# Altium project PuttPilot-Node.PrjPcb (part 2 of 2)

## Sheet Servo-Power.SchDoc: Servo-Power
size 279 x 215 mm; DrawnBy: Ethan Abraham; Engineer: ethan Abraham; SheetNumber: 3; SheetTotal: 6
Used 3 times, as channels B1, B2, B3. Parts and nets are listed once, with the designators drawn on the sheet.
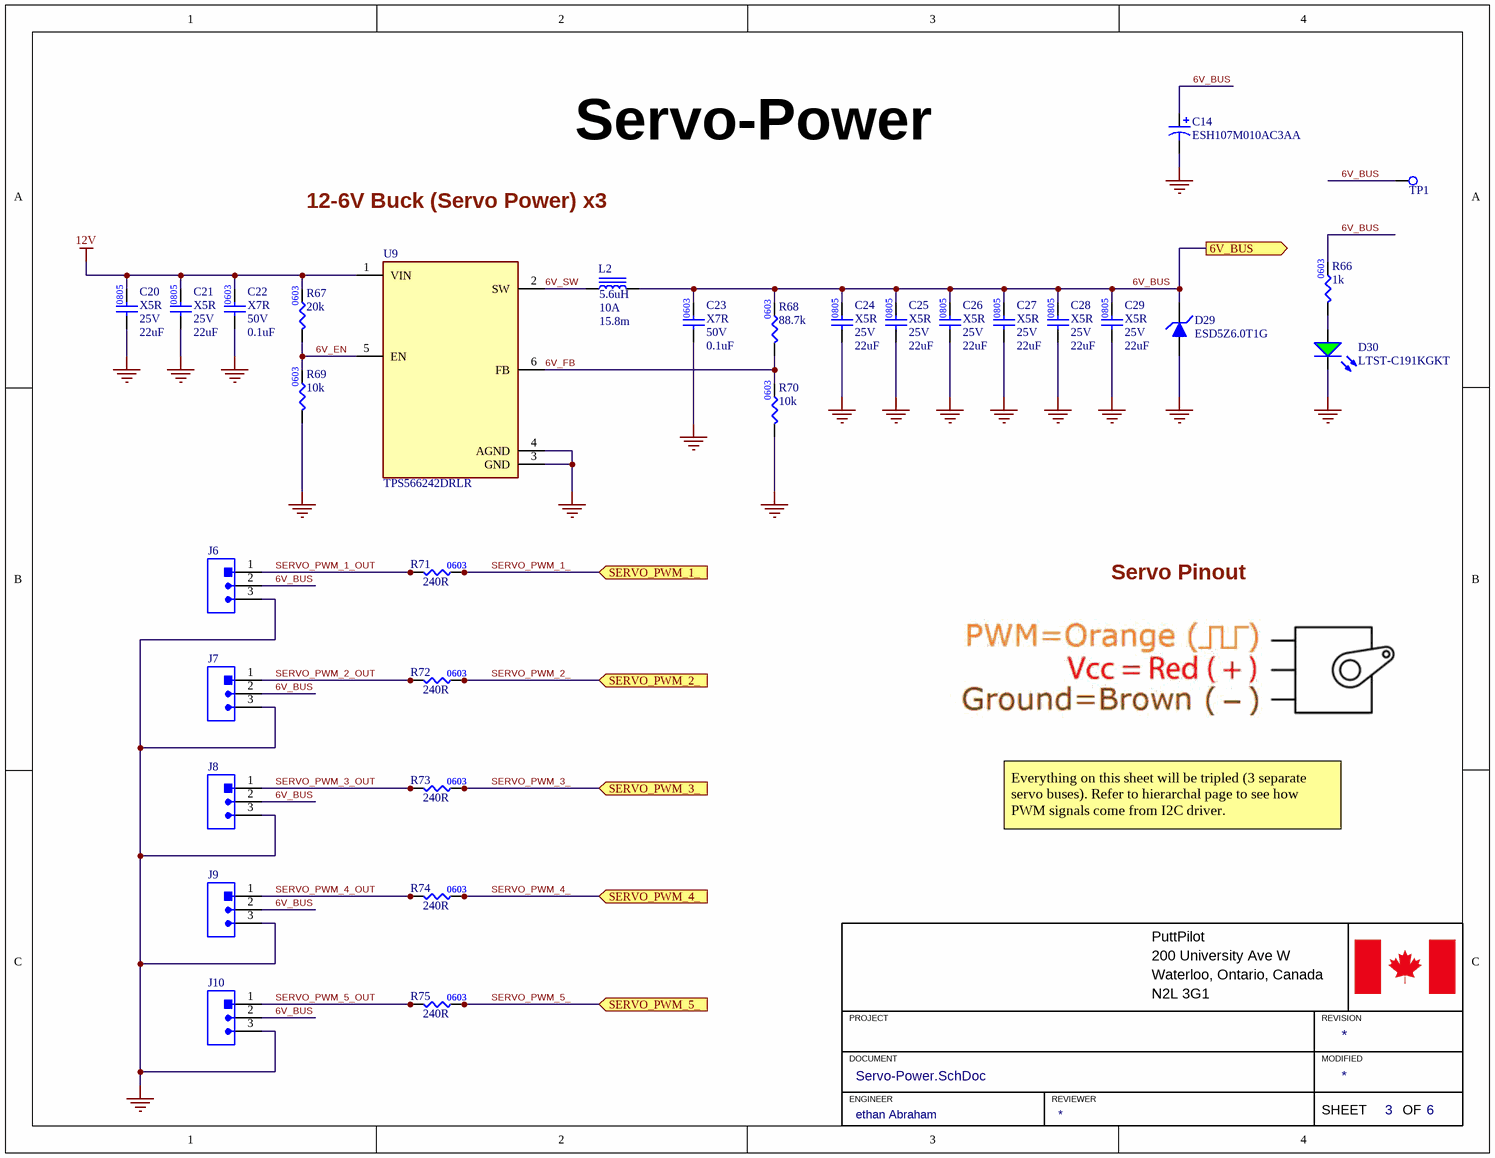
[diagram p3: Servo-Power.SchDoc]

### Parts
C14  ESH107M010AC3AA  [ESH107M010AC3AA]
C20  Temperature Characteristics Code: X5R  Rated DC Voltage (URdc): 25V  Capacitance: 22uF  [.CAP_0805]  (hidden comment: GRM21BR61E226ME44K)
C21  Temperature Characteristics Code: X5R  Rated DC Voltage (URdc): 25V  Capacitance: 22uF  [.CAP_0805]  (hidden comment: GRM21BR61E226ME44K)
C22  Temperature Characteristics Code: X7R  Rated DC Voltage (URdc): 50V  Capacitance: 0.1uF  [.CAP_0603]  (hidden comment: GCJ188R71H104KA12D)
C23  Temperature Characteristics Code: X7R  Rated DC Voltage (URdc): 50V  Capacitance: 0.1uF  [.CAP_0603]  (hidden comment: GCJ188R71H104KA12D)
C24  Temperature Characteristics Code: X5R  Rated DC Voltage (URdc): 25V  Capacitance: 22uF  [.CAP_0805]  (hidden comment: GRM21BR61E226ME44K)
C25  Temperature Characteristics Code: X5R  Rated DC Voltage (URdc): 25V  Capacitance: 22uF  [.CAP_0805]  (hidden comment: GRM21BR61E226ME44K)
C26  Temperature Characteristics Code: X5R  Rated DC Voltage (URdc): 25V  Capacitance: 22uF  [.CAP_0805]  (hidden comment: GRM21BR61E226ME44K)
C27  Temperature Characteristics Code: X5R  Rated DC Voltage (URdc): 25V  Capacitance: 22uF  [.CAP_0805]  (hidden comment: GRM21BR61E226ME44K)
C28  Temperature Characteristics Code: X5R  Rated DC Voltage (URdc): 25V  Capacitance: 22uF  [.CAP_0805]  (hidden comment: GRM21BR61E226ME44K)
C29  Temperature Characteristics Code: X5R  Rated DC Voltage (URdc): 25V  Capacitance: 22uF  [.CAP_0805]  (hidden comment: GRM21BR61E226ME44K)
D29  ESD5Z6.0T1G  [ESD5Z6.0T1G]
D30  LTST-C191KGKT  [.LED_0603]
J6  PRPC040SAAN-RC  [HEADER_3POS_2.54MM]  (value not drawn)
J7  PRPC040SAAN-RC  [HEADER_3POS_2.54MM]  (value not drawn)
J8  PRPC040SAAN-RC  [HEADER_3POS_2.54MM]  (value not drawn)
J9  PRPC040SAAN-RC  [HEADER_3POS_2.54MM]  (value not drawn)
J10  PRPC040SAAN-RC  [HEADER_3POS_2.54MM]  (value not drawn)
L2  Inductance: 5.6uH  Current Rating: 10A  DC Resistance: 15.8m  [SRP6060FA-5R6M]  (hidden comment: SRP6060FA-5R6M)
R66  Resistance: 1k  [.RES_0603]  (hidden comment: RC0603FR-071KL)
R67  Resistance: 20k  [.RES_0603]  (hidden comment: ERJ-3EKF2002V)
R68  Resistance: 88.7k  [.RES_0603]  (hidden comment: RC0603FR-0788K7L)
R69  Resistance: 10k  [.RES_0603]  (hidden comment: RC0603FR-0710KL)
R70  Resistance: 10k  [.RES_0603]  (hidden comment: RC0603FR-0710KL)
R71  Resistance: 240R  [.RES_0603]  (hidden comment: RC0603FR-07240RL)
R72  Resistance: 240R  [.RES_0603]  (hidden comment: RC0603FR-07240RL)
R73  Resistance: 240R  [.RES_0603]  (hidden comment: RC0603FR-07240RL)
R74  Resistance: 240R  [.RES_0603]  (hidden comment: RC0603FR-07240RL)
R75  Resistance: 240R  [.RES_0603]  (hidden comment: RC0603FR-07240RL)
TP1  RCWCTE  [RCWCTE]  (value not drawn)
U9  TPS566242DRLR  [TPS566242DRLR]

### Ports
6V_BUS (out), SERVO_PWM_1_ (in), SERVO_PWM_2_ (in), SERVO_PWM_3_ (in), SERVO_PWM_4_ (in), SERVO_PWM_5_ (in)

### Nets
12V: C20.2 C21.2 C22.2 R67.2 U9.1(VIN)
GND: C14.2 C20.1 C21.1 C22.1 C23.1 C24.1 C25.1 C26.1 C27.1 C28.1 C29.1 D29.2(Anode) D30.2(K) J6.3 J7.3 J8.3 J9.3 J10.3 R69.1 R70.1 U9.3(GND) U9.4(AGND)
6V_BUS: C14.1 C23.2 C24.2 C25.2 C26.2 C27.2 C28.2 C29.2 D29.1(Cathode) J6.2 J7.2 J8.2 J9.2 J10.2 L2.2 R66.2 R68.2 TP1.1 ; port 6V_BUS
6V_EN: R67.1 R69.2 U9.5(EN)
6V_FB: R68.1 R70.2 U9.6(FB)
6V_SW: L2.1 U9.2(SW)
SERVO_PWM_1_: R71.2 ; port SERVO_PWM_1_
SERVO_PWM_1_OUT: J6.1 R71.1
SERVO_PWM_2_: R72.2 ; port SERVO_PWM_2_
SERVO_PWM_2_OUT: J7.1 R72.1
SERVO_PWM_3_: R73.2 ; port SERVO_PWM_3_
SERVO_PWM_3_OUT: J8.1 R73.1
SERVO_PWM_4_: R74.2 ; port SERVO_PWM_4_
SERVO_PWM_4_OUT: J9.1 R74.1
SERVO_PWM_5_: R75.2 ; port SERVO_PWM_5_
SERVO_PWM_5_OUT: J10.1 R75.1
NetD30_1: D30.1(A) R66.1

### Channels
B1: designators end in _B1; ports 6V_BUS=6V_BUS_B1 SERVO_PWM_1_=SERVO_PWM_1__B1 SERVO_PWM_2_=SERVO_PWM_2__B1 SERVO_PWM_3_=SERVO_PWM_3__B1 SERVO_PWM_4_=SERVO_PWM_4__B1 SERVO_PWM_5_=SERVO_PWM_5__B1
B2: designators end in _B2; ports 6V_BUS=6V_BUS_B2 SERVO_PWM_1_=SERVO_PWM_1__B2 SERVO_PWM_2_=SERVO_PWM_2__B2 SERVO_PWM_3_=SERVO_PWM_3__B2 SERVO_PWM_4_=SERVO_PWM_4__B2 SERVO_PWM_5_=SERVO_PWM_5__B2
B3: designators end in _B3; ports 6V_BUS=6V_BUS SERVO_PWM_1_=SERVO_PWM_1__B3 SERVO_PWM_2_=SERVO_PWM_2__B3 SERVO_PWM_3_=SERVO_PWM_3__B3 SERVO_PWM_4_=SERVO_PWM_4__B3 SERVO_PWM_5_=SERVO_PWM_5__B3

### Notes on the sheet
- 12-6V Buck (Servo Power) x3
- Servo Pinout
- Everything on this sheet will be tripled (3 separate servo buses). Refer to hierarchal page to see how PWM signals come from I2C driver.
- PuttPilot
- 200 University Ave W
- PROJECT
- Waterloo, Ontario, Canada
- N2L 3G1
- REVISION
- DOCUMENT
- ENGINEER
- REVIEWER
- MODIFIED
- SHEET
- OF

### Library data of the parts
C14 = ESH107M010AC3AA: CAP ALUM 100uF 10V RAD THT
C20 C21 C24-C29 = GRM21BR61E226ME44K: CAP CER 22uF 25V X5R 0805; Manufacturer: Murata; Dielectric Material: Ceramic; Multilayer: Yes; Negative Tolerance: 20%; Supplier 1: Future Electronics; Manufacturer Part Number: GRM21BR61E226ME44K; RoHS: Yes; Category: Ceramic Capacitors; Stock 1: 60000; Pricing 1: 10000=0.0684, 20000=0.0672, 30000=0.0661 (USD); Mount: Surface Mount; Number of Pins: 2; Package Shape: Rectangular; Size Code: 0805; Terminal Finish: Nickel; Min Operating Temperature: -55°C; Max Operating Temperature: 85°C; JESD-609 Code: e3; Capacitor Type: Ceramic; Package Style: SMTMeter; Packaging: Tape and Reel; Positive Tolerance: 20%; Termination: Wraparound; Length: 2mm; Width: 1.25mm; Height: 1.25mm; Reach SVHC Compliant: Yes; RoHS Compliant: Yes; ComponentLink1URL: https://datasheet.ciiva.com:443/pdfs/VipMasterIC/IC/MURE/MURE-S-A0002977178/MURE-S-A0002978778-1.pdf?src-supplier=IHS+Markit; ComponentLink1Description: https://datasheet.ciiva.com:443/pdfs/VipMasterIC/IC/MURE/MURE-S-A0002977178/MURE-S-A0002978778-1.pdf?src-supplier=IHS+Markit; ComponentLink2URL: http://www.mouser.com/ds/2/281/c02e-2905.pdf?src-supplier=Mouser; ComponentLink2Description: http://www.mouser.com/ds/2/281/c02e-2905.pdf?src-supplier=Mouser; ComponentLink3URL: https://datasheet.octopart.com/GRM21BR61E226ME44K-Murata-datasheet-155345081.pdf?src-supplier=Element14; ComponentLink3Description: https://datasheet.octopart.com/GRM21BR61E226ME44K-Murata-datasheet-155345081.pdf?src-supplier=Element14; ComponentLink4URL: http://search.murata.co.jp/Ceramy/image/img/A01X/G101/ENG/GRM21BR61E226ME44-01.pdf?src-supplier=Digikey; ComponentLink4Description: http://search.murata.co.jp/Ceramy/image/img/A01X/G101/ENG/GRM21BR61E226ME44-01.pdf?src-supplier=Digikey; ComponentLink5URL: https://search.murata.co.jp/Ceramy/image/img/A01X/G101/ENG/GRM21BR61E226ME44-01.pdf?src-supplier=Digikey; ComponentLink5Description: https://search.murata.co.jp/Ceramy/image/img/A01X/G101/ENG/GRM21BR61E226ME44-01.pdf?src-supplier=Digikey; ComponentLink6URL: https://datasheet.octopart.com/GRM21BR61E226ME44K-Murata-datasheet-99353850.pdf?src-supplier=Future+Electronics; ComponentLink6Description: https://datasheet.octopart.com/GRM21BR61E226ME44K-Murata-datasheet-99353850.pdf?src-supplier=Future+Electronics; ComponentLink7URL: https://datasheet.octopart.com/GRM21BR61E226ME44K-Murata-datasheet-155345081.pdf?src-supplier=Newark; ComponentLink7Description: https://datasheet.octopart.com/GRM21BR61E226ME44K-Murata-datasheet-155345081.pdf?src-supplier=Newark; ComponentLink8URL: https://datasheet.octopart.com/GRM21BR61E226ME44K-Murata-datasheet-165579666.pdf?src-supplier=TME; ComponentLink8Description: https://datasheet.octopart.com/GRM21BR61E226ME44K-Murata-datasheet-165579666.pdf?src-supplier=TME; Supplier Part Number 1: 1092989
C22 C23 = GCJ188R71H104KA12D: CAP CER 0.1uF 50V X7R 0603; Manufacturer: Murata; Dielectric Material: Ceramic; Multilayer: Yes; Negative Tolerance: 10%; Reference Standard: AEC-Q200; Supplier 1: Future Electronics; Manufacturer Part Number: GCJ188R71H104KA12D; RoHS: Yes; Category: Ceramic Capacitors; Stock 1: 3280000; Pricing 1: 4000=0.0182, 12000=0.0178, 20000=0.0176, 80000=0.017, 120000=0.0167 (USD); Mount: Surface Mount; Number of Pins: 2; Package Shape: Rectangular; Size Code: 0603; Terminal Finish: Nickel; Min Operating Temperature: -55°C; Max Operating Temperature: 125°C; JESD-609 Code: e3; Capacitor Type: Ceramic; Package Style: SMTMeter; Packaging: Tape and Reel; Positive Tolerance: 10%; Termination: Wraparound; Length: 1.6mm; Width: 0.8mm; Height: 0.8mm; Reach SVHC Compliant: Yes; RoHS Compliant: Yes; ComponentLink1URL: https://psearch.en.murata.com:443/capacitor/product/GCJ188R71H104KA12%23.pdf?src-supplier=IHS+Markit; ComponentLink1Description: https://psearch.en.murata.com:443/capacitor/product/GCJ188R71H104KA12%23.pdf?src-supplier=IHS+Markit; ComponentLink2URL: https://datasheet.ciiva.com/135/product-135604.pdf?src-supplier=Digikey; ComponentLink2Description: https://datasheet.ciiva.com/135/product-135604.pdf?src-supplier=Digikey; ComponentLink3URL: https://datasheet.ciiva.com/26889/getdatasheetpartid-369886-26889118.pdf?src-supplier=Verical; ComponentLink3Description: https://datasheet.ciiva.com/26889/getdatasheetpartid-369886-26889118.pdf?src-supplier=Verical; ComponentLink4URL: https://datasheet.ciiva.com/135/s0717e-135605.pdf?src-supplier=Digikey; ComponentLink4Description: https://datasheet.ciiva.com/135/s0717e-135605.pdf?src-supplier=Digikey; ComponentLink5URL: https://datasheet.ciiva.com/135/s0717e-135606.pdf?src-supplier=Digikey; ComponentLink5Description: https://datasheet.ciiva.com/135/s0717e-135606.pdf?src-supplier=Digikey; ComponentLink6URL: https://datasheet.ciiva.com/16440/c03e-16440425.pdf?src-supplier=Future+Electronics; ComponentLink6Description: https://datasheet.ciiva.com/16440/c03e-16440425.pdf?src-supplier=Future+Electronics; Supplier Part Number 1: 1158604
D29 = ESD5Z6.0T1G: DIODE TVS 6VWM; Manufacturer: ON Semiconductor; Diode Element Material: SILICON; Package Body Material: Plastic; Polarity: Unidirectional; Additional Feature: UL RECOGNIZED; Min Breakdown Voltage: 6.8V; Clamping Voltage-Max: 12.4V; Diode Type: TRANS VOLTAGE SUPPRESSOR; Non-rep Peak Rev Power Dis-Max: 181W; Number of Elements: 1; Max Power Dissipation: 200mW; Rep Pk Reverse Voltage-Max: 6V; Time @ Peak Reflow Temperature-Max (s): 40s; Reference Standard: IEC-61000-4-2; Qualification Status: Not Qualified; Supplier 1: Future Electronics; Manufacturer Part Number: ESD5Z6.0T1G; RoHS: Yes; Category: ESD and Circuit Protection ICs; Stock 1: 543000; Pricing 1: 3000=0.0199, 12000=0.0191, 45000=0.0183, 75000=0.018, 150000=0.0171 (USD); Number of Pins: 2; Package Shape: Rectangular; Terminal Finish: Tin; Min Operating Temperature: -55°C; Max Operating Temperature: 150°C; JESD-609 Code: e3; JESD-30 Code: R-PDSO-F2; Moisture Sensitivity Level: 1; Package Style: SMALL OUTLINEMeter; Surface Mount: Yes; Technology: AVALANCHE; Terminal Form: Flat; Terminal Position: DUAL; Peak Reflow Temperature (Cel): 260°C; Reach SVHC Compliant: Yes; RoHS Compliant: Yes; ComponentLink1URL: https://datasheet.ciiva.com:443/pdfs/VipMasterIC/IC/ONSM/ONSM-S-A0006325923/ONSM-S-A0006325923-1.pdf?src-supplier=IHS+Markit; ComponentLink1Description: https://datasheet.ciiva.com:443/pdfs/VipMasterIC/IC/ONSM/ONSM-S-A0006325923/ONSM-S-A0006325923-1.pdf?src-supplier=IHS+Markit; ComponentLink2URL: https://datasheet.ciiva.com/30478/0900766b8125092b-30478790.pdf?src-supplier=Rs; ComponentLink2Description: https://datasheet.ciiva.com/30478/0900766b8125092b-30478790.pdf?src-supplier=Rs; ComponentLink3URL: https://datasheet.ciiva.com/4510/esd5z2-5t1-d-241596-4510609.pdf?src-supplier=Mouser; ComponentLink3Description: https://datasheet.ciiva.com/4510/esd5z2-5t1-d-241596-4510609.pdf?src-supplier=Mouser; ComponentLink4URL: https://datasheet.ciiva.com/15143/getdatasheetpartid-148103-15143777.pdf?src-supplier=Verical; ComponentLink4Description: https://datasheet.ciiva.com/15143/getdatasheetpartid-148103-15143777.pdf?src-supplier=Verical; ComponentLink5URL: https://datasheet.ciiva.com/22642/1878252-22642024.pdf?src-supplier=Element14; ComponentLink5Description: https://datasheet.ciiva.com/22642/1878252-22642024.pdf?src-supplier=Element14; ComponentLink6URL: https://datasheet.ciiva.com/340/esd5z2-5t1-d-340699.pdf?src-supplier=Digikey; ComponentLink6Description: https://datasheet.ciiva.com/340/esd5z2-5t1-d-340699.pdf?src-supplier=Digikey; ComponentLink7URL: https://datasheet.ciiva.com/340/esd5z2-5t1-d-340700.pdf?src-supplier=Digikey; ComponentLink7Description: https://datasheet.ciiva.com/340/esd5z2-5t1-d-340700.pdf?src-supplier=Digikey; ComponentLink8URL: https://datasheet.ciiva.com/340/esd5z2-5t1-d-340701.pdf?src-supplier=Digikey; ComponentLink8Description: https://datasheet.ciiva.com/340/esd5z2-5t1-d-340701.pdf?src-supplier=Digikey; ComponentLink9URL: https://datasheet.ciiva.com/3304/esd5z2-5t1-d-3304009.pdf?src-supplier=Avnet; ComponentLink9Description: https://datasheet.ciiva.com/3304/esd5z2-5t1-d-3304009.pdf?src-supplier=Avnet; Supplier Part Number 1: 6072663
D30 = LTST-C191KGKT: LED GREEN 2V 0603; Manufacturer: Vishay Lite-On; Shape: Rectangular; Lens Style: WATER CLEAR; Forward Current-Max: 30mA; Luminous Intensity-Nom: 35mcd; Number of Functions: 1; Optoelectronic Device Type: SINGLE COLOR LED; Viewing Angle: 130°; Forward Voltage-Max: 2.4V; Reverse Voltage-Max: 5V; Overall Height: 0.55mm; Supplier 1: Digikey; Manufacturer Part Number: LTST-C191KGKT; RoHS: Yes; Stock 1: 171853; Pricing 1: 1=0.22, 10=0.121, 100=0.0721, 500=0.05324, 1000=0.04748, 2000=0.04278 (USD); Mount: Surface Mount; Number of Pins: 2; Color: Green; Color@wavelength: Green; Terminal Finish: Tin; Min Operating Temperature: -55°C; Max Operating Temperature: 85°C; Packaging: Tape and Reel; JESD-609 Code: e3; Size: 1.1mm; Terminal Pitch: 1.5mm; Reach SVHC Compliant: Yes; RoHS Compliant: Yes; ComponentLink1URL: https://datasheet.ciiva.com:443/pdfs/VipMasterIC/IC/LITE/LITE-S-A0003156116/LITE-S-A0003156116-1.pdf?src-supplier=IHS+Markit; ComponentLink1Description: https://datasheet.ciiva.com:443/pdfs/VipMasterIC/IC/LITE/LITE-S-A0003156116/LITE-S-A0003156116-1.pdf?src-supplier=IHS+Markit; ComponentLink2URL: https://datasheet.ciiva.com/2109/ltst-c191kgkt-2109973.pdf?src-supplier=Digikey; ComponentLink2Description: https://datasheet.ciiva.com/2109/ltst-c191kgkt-2109973.pdf?src-supplier=Digikey; Supplier Part Number 1: 160-1446-1-ND
J6-J10 = PRPC040SAAN-RC: CONN HEADER VERT 3POS 2.54MM; Manufacturer: Sullins; Manufacturer Series: PRP; Connector Type: BOARD CONNECTOR; Contact Pattern: RECTANGULAR; Contact Style: SQ PIN-SKT; Number Of Connectors: 1; Rated Current (Signal): 3A; Number of Contacts: 40; Body Breadth: 0.1inch; Body Length: 4inch; Reference Standard: UL; Reliability: COMMERCIAL; Supplier 1: Digikey; Manufacturer Part Number: PRPC040SAAN-RC; RoHS: Yes; Category: Headers and Wire Housings; Stock 1: 73516; Pricing 1: 1=0.42, 10=0.316, 100=0.2417, 500=0.2017, 1000=0.18701, 5000=0.15795, 10000=0.14845 (USD); Mount: Board; Contact Material: Brass; Contact Finish - Mating: AU ON NI; Contact Finish - Termination: Gold (Au) - with Nickel (Ni) barrier; Insulation Material: Polybutylene; Min Operating Temperature: -40°C; Max Operating Temperature: 105°C; JESD-609 Code: e4; Contact Gender: Male; Mounting Style: STRAIGHT; Number Of PCB Rows: 1; Number of Rows Loaded: 1; PCB Contact Pattern: RECTANGULAR; Termination: Solder; Body Depth: 0.1inch; Mating Contact Pitch: 0.1inch; Terminal Length: 0.12inch; Terminal Pitch: 2.54mm; Reach SVHC Compliant: Yes; RoHS Compliant: Yes; ComponentLink1URL: https://datasheet.ciiva.com:443/pdfs/VipMasterIC/IC/SUCS/SUCSS00322/SUCSS00322-1.pdf?src-supplier=IHS+Markit; ComponentLink1Description: https://datasheet.ciiva.com:443/pdfs/VipMasterIC/IC/SUCS/SUCSS00322/SUCSS00322-1.pdf?src-supplier=IHS+Markit; ComponentLink2URL: https://datasheet.ciiva.com/16477/prpc040saan-rc-16477647.pdf?src-supplier=Future+Electronics; ComponentLink2Description: https://datasheet.ciiva.com/16477/prpc040saan-rc-16477647.pdf?src-supplier=Future+Electronics; ComponentLink3URL: https://datasheet.ciiva.com/741/xrxczzzsxxn-rc-st-11635-b-741205.pdf?src-supplier=Digikey; ComponentLink3Description: https://datasheet.ciiva.com/741/xrxczzzsxxn-rc-st-11635-b-741205.pdf?src-supplier=Digikey; Supplier Part Number 1: S1011EC-02-ND
L2 = SRP6060FA-5R6M: FIXED IND 5.6uH 10A 15.8mOhm; Manufacturer: Bourns; Inductor Type: GENERAL PURPOSE INDUCTOR; Supplier 1: Digikey; Manufacturer Part Number: SRP6060FA-5R6M; RoHS: Yes; Category: Fixed Inductors; Stock 1: 1553; Pricing 1: 1=1.86, 10=1.444, 25=1.3052, 50=1.209, 100=1.1199, 250=1.01164 (USD); Reach SVHC Compliant: Yes; RoHS Compliant: Yes; ComponentLink1URL: https://datasheet.ciiva.com:443/pdfs/VipMasterIC/IC/BOUR/BOUR-S-A0006601820/BOUR-S-A0006601820-1.pdf?src-supplier=IHS+Markit; ComponentLink1Description: https://datasheet.ciiva.com:443/pdfs/VipMasterIC/IC/BOUR/BOUR-S-A0006601820/BOUR-S-A0006601820-1.pdf?src-supplier=IHS+Markit; ComponentLink2URL: https://www.bourns.com/docs/Product-Datasheets/SRP6060FA.pdf?src-supplier=Digikey; ComponentLink2Description: https://www.bourns.com/docs/Product-Datasheets/SRP6060FA.pdf?src-supplier=Digikey; ComponentLink3URL: https://datasheet.octopart.com/SRP6060FA-5R6M-Bourns-datasheet-154834317.pdf?src-supplier=Electro+Sonic; ComponentLink3Description: https://datasheet.octopart.com/SRP6060FA-5R6M-Bourns-datasheet-154834317.pdf?src-supplier=Electro+Sonic; ComponentLink4URL: https://datasheet.octopart.com/SRP6060FA-5R6M-Bourns-datasheet-110646386.pdf?src-supplier=Master+Electronics; ComponentLink4Description: https://datasheet.octopart.com/SRP6060FA-5R6M-Bourns-datasheet-110646386.pdf?src-supplier=Master+Electronics; Supplier Part Number 1: SRP6060FA-5R6MCT-ND
R66 = RC0603FR-071KL: RES 1K OHM 0603; Manufacturer: Yageo; Tolerance: 1%; Additional Feature: LASER TRIMMABLE; Rated Power Dissipation (P): 100mW; Rated Temperature: 70°C; Temperature Coefficient: 100ppm/°C; Working Voltage: 75V; Package Height: 0.45mm; Package Length: 1.6mm; Package Width: 0.8mm; Supplier 1: Future Electronics; Manufacturer Part Number: RC0603FR-071KL; RoHS: Yes; Category: Chip SMD Resistors; Stock 1: 12810000; Pricing 1: 5000=0.0026, 50000=0.0025, 150000=0.0024, 375000=0.0023, 1000000=0.0022 (USD); Mount: Surface Mount; Number of Pins: 2; Package Shape: Rectangular; Size Code: 0603; Terminal Finish: Nickel; Min Operating Temperature: -55°C; Max Operating Temperature: 155°C; JESD-609 Code: e3; Resistor Type: FIXED RESISTOR; Construction: Chip; Package Style: SMTMeter; Packaging: Tape and Reel; Technology: METAL GLAZE/THICK FILM; Termination: Wraparound; Reach SVHC Compliant: Yes; RoHS Compliant: Yes; ComponentLink1URL: https://datasheet.ciiva.com:443/pdfs/VipMasterIC/IC/YAGO/YAGO-S-A0008145938/YAGO-S-A0008145938-1.pdf?src-supplier=IHS+Markit; ComponentLink1Description: https://datasheet.ciiva.com:443/pdfs/VipMasterIC/IC/YAGO/YAGO-S-A0008145938/YAGO-S-A0008145938-1.pdf?src-supplier=IHS+Markit; ComponentLink2URL: https://datasheet.ciiva.com/11808/0900766b80f96399-11808081.pdf?src-supplier=Rs; ComponentLink2Description: https://datasheet.ciiva.com/11808/0900766b80f96399-11808081.pdf?src-supplier=Rs; ComponentLink3URL: https://datasheet.ciiva.com/8896/pyu-rc0603-51-rohs-l-4-8896106.pdf?src-supplier=Avnet; ComponentLink3Description: https://datasheet.ciiva.com/8896/pyu-rc0603-51-rohs-l-4-8896106.pdf?src-supplier=Avnet; ComponentLink4URL: https://datasheet.ciiva.com/7660/1868787-7660790.pdf?src-supplier=Element14; ComponentLink4Description: https://datasheet.ciiva.com/7660/1868787-7660790.pdf?src-supplier=Element14; ComponentLink5URL: https://datasheet.ciiva.com/7746/1738695-7746279.pdf?src-supplier=Element14; ComponentLink5Description: https://datasheet.ciiva.com/7746/1738695-7746279.pdf?src-supplier=Element14; ComponentLink6URL: https://datasheet.ciiva.com/7746/1686128-7746280.pdf?src-supplier=Element14; ComponentLink6Description: https://datasheet.ciiva.com/7746/1686128-7746280.pdf?src-supplier=Element14; ComponentLink7URL: https://datasheet.ciiva.com/7746/1738695-7746281.pdf?src-supplier=Element14; ComponentLink7Description: https://datasheet.ciiva.com/7746/1738695-7746281.pdf?src-supplier=Element14; ComponentLink8URL: https://datasheet.ciiva.com/7983/443971-7983613.pdf?src-supplier=Element14; ComponentLink8Description: https://datasheet.ciiva.com/7983/443971-7983613.pdf?src-supplier=Element14; ComponentLink9URL: https://datasheet.ciiva.com/15189/getdatasheetpartid-404327-15189644.pdf?src-supplier=Verical; ComponentLink9Description: https://datasheet.ciiva.com/15189/getdatasheetpartid-404327-15189644.pdf?src-supplier=Verical; Supplier Part Number 1: 4016291
R67 = ERJ-3EKF2002V: RES 20K OHM 0603; Manufacturer: Panasonic; Tolerance: 1%; Rated Power Dissipation (P): 100mW; Rated Temperature: 70°C; Temperature Coefficient: 100ppm/°C; Working Voltage: 75V; Package Height: 0.45mm; Package Length: 1.6mm; Package Width: 0.8mm; Reference Standard: AEC-Q200; Supplier 1: Mouser; Manufacturer Part Number: ERJ-3EKF2002V; RoHS: Yes; Category: Chip SMD Resistors; Stock 1: 221599; Pricing 1: 1=0.1, 10=0.02, 50=0.02, 100=0.012, 1000=0.009, 5000=0.005, 10000=0.005, 25000=0.004 (USD); Mount: Surface Mount; Number of Pins: 2; Package Shape: Rectangular; Size Code: 0603; Terminal Finish: Nickel; Min Operating Temperature: -55°C; Max Operating Temperature: 155°C; JESD-609 Code: e3; Resistor Type: FIXED RESISTOR; Construction: Rectangular; Package Style: SMTMeter; Packaging: Tape and Reel; Technology: METAL GLAZE/THICK FILM; Termination: Wraparound; RoHS Compliant: Yes; Reach SVHC Compliant: Yes; ComponentLink1URL: https://datasheet.ciiva.com:443/pdfs/VipMasterIC/IC/PANA/PANA-S-A0009889626/PANA-S-A0009889626-1.pdf?src-supplier=IHS+Markit; ComponentLink1Description: https://datasheet.ciiva.com:443/pdfs/VipMasterIC/IC/PANA/PANA-S-A0009889626/PANA-S-A0009889626-1.pdf?src-supplier=IHS+Markit; ComponentLink2URL: https://datasheet.ciiva.com/15158/getdatasheetpartid-248555-15158987.pdf?src-supplier=Verical; ComponentLink2Description: https://datasheet.ciiva.com/15158/getdatasheetpartid-248555-15158987.pdf?src-supplier=Verical; ComponentLink3URL: https://datasheet.ciiva.com/28688/1678782-28688604.pdf?src-supplier=Element14; ComponentLink3Description: https://datasheet.ciiva.com/28688/1678782-28688604.pdf?src-supplier=Element14; ComponentLink4URL: https://datasheet.ciiva.com/46377/1678782-46377365.pdf?src-supplier=Element14; ComponentLink4Description: https://datasheet.ciiva.com/46377/1678782-46377365.pdf?src-supplier=Element14; ComponentLink5URL: https://datasheet.ciiva.com/22749/1678782-22749661.pdf?src-supplier=Element14; ComponentLink5Description: https://datasheet.ciiva.com/22749/1678782-22749661.pdf?src-supplier=Element14; ComponentLink6URL: https://datasheet.ciiva.com/30218/aoa0000ce2-30218069.pdf?src-supplier=Onlinecomponents.com; ComponentLink6Description: https://datasheet.ciiva.com/30218/aoa0000ce2-30218069.pdf?src-supplier=Onlinecomponents.com; Supplier Part Number 1: 667-ERJ-3EKF2002V
R68 = RC0603FR-0788K7L: RES 88.7K OHM 0603; Manufacturer: Yageo; Tolerance: 1%; Additional Feature: LASER TRIMMABLE; Rated Power Dissipation (P): 100mW; Rated Temperature: 70°C; Temperature Coefficient: 100ppm/°C; Working Voltage: 75V; Package Height: 0.45mm; Package Length: 1.6mm; Package Width: 0.8mm; Supplier 1: Future Electronics; Manufacturer Part Number: RC0603FR-0788K7L; RoHS: Yes; Category: Chip SMD Resistors; Stock 1: 485000; Pricing 1: 5000=0.0014, 50000=0.0025, 75000=0.0013, 150000=0.0024, 250000=0.0013, 375000=0.0023, 750000=0.0012, 1000000=0.0022, 2500000=0.0011 (USD); Mount: Surface Mount; Number of Pins: 2; Package Shape: Rectangular; Size Code: 0603; Terminal Finish: Nickel; Min Operating Temperature: -55°C; Max Operating Temperature: 155°C; JESD-609 Code: e3; Resistor Type: FIXED RESISTOR; Construction: Chip; Package Style: SMTMeter; Packaging: Tape and Reel; Technology: METAL GLAZE/THICK FILM; Termination: Wraparound; Reach SVHC Compliant: Yes; RoHS Compliant: Yes; ComponentLink1URL: https://datasheet.ciiva.com:443/pdfs/VipMasterIC/IC/YAGO/YAGO-S-A0008145938/YAGO-S-A0008145938-1.pdf?src-supplier=IHS+Markit; ComponentLink1Description: https://datasheet.ciiva.com:443/pdfs/VipMasterIC/IC/YAGO/YAGO-S-A0008145938/YAGO-S-A0008145938-1.pdf?src-supplier=IHS+Markit; ComponentLink2URL: https://datasheet.ciiva.com/2454/pyu-r-int-thick-7-2454108.pdf?src-supplier=Digikey; ComponentLink2Description: https://datasheet.ciiva.com/2454/pyu-r-int-thick-7-2454108.pdf?src-supplier=Digikey; ComponentLink3URL: https://datasheet.ciiva.com/2454/pyu-r-int-thick-7-2454109.pdf?src-supplier=Digikey; ComponentLink3Description: https://datasheet.ciiva.com/2454/pyu-r-int-thick-7-2454109.pdf?src-supplier=Digikey; ComponentLink4URL: https://datasheet.ciiva.com/2454/pyu-r-int-thick-7-2454110.pdf?src-supplier=Digikey; ComponentLink4Description: https://datasheet.ciiva.com/2454/pyu-r-int-thick-7-2454110.pdf?src-supplier=Digikey; ComponentLink5URL: https://datasheet.ciiva.com/8883/pyu-rc0603-51-rohs-l-4-8883082.pdf?src-supplier=Avnet; ComponentLink5Description: https://datasheet.ciiva.com/8883/pyu-rc0603-51-rohs-l-4-8883082.pdf?src-supplier=Avnet; Supplier Part Number 1: 6138945
R69 R70 = RC0603FR-0710KL: RES 10K OHM 0603; Manufacturer: Yageo; Tolerance: 1%; Additional Feature: LASER TRIMMABLE; Rated Power Dissipation (P): 100mW; Rated Temperature: 70°C; Temperature Coefficient: 100ppm/°C; Working Voltage: 75V; Package Height: 0.45mm; Package Length: 1.6mm; Package Width: 0.8mm; Supplier 1: Future Electronics; Manufacturer Part Number: RC0603FR-0710KL; RoHS: Yes; Category: Chip SMD Resistors; Stock 1: 30355000; Pricing 1: 5000=0.0026, 50000=0.0025, 150000=0.0024, 375000=0.0023, 1000000=0.0022 (USD); Mount: Surface Mount; Number of Pins: 2; Package Shape: Rectangular; Size Code: 0603; Terminal Finish: Nickel; Min Operating Temperature: -55°C; Max Operating Temperature: 155°C; JESD-609 Code: e3; Resistor Type: FIXED RESISTOR; Construction: Chip; Package Style: SMTMeter; Packaging: Tape and Reel; Technology: METAL GLAZE/THICK FILM; Termination: Wraparound; Reach SVHC Compliant: Yes; RoHS Compliant: Yes; ComponentLink1URL: https://datasheet.ciiva.com:443/pdfs/VipMasterIC/IC/YAGO/YAGO-S-A0008145938/YAGO-S-A0008145938-1.pdf?src-supplier=IHS+Markit; ComponentLink1Description: https://datasheet.ciiva.com:443/pdfs/VipMasterIC/IC/YAGO/YAGO-S-A0008145938/YAGO-S-A0008145938-1.pdf?src-supplier=IHS+Markit; ComponentLink2URL: https://datasheet.ciiva.com/22747/443971-22747519.pdf?src-supplier=Element14; ComponentLink2Description: https://datasheet.ciiva.com/22747/443971-22747519.pdf?src-supplier=Element14; ComponentLink3URL: https://datasheet.ciiva.com/46440/1868787-46440891.pdf?src-supplier=Element14; ComponentLink3Description: https://datasheet.ciiva.com/46440/1868787-46440891.pdf?src-supplier=Element14; ComponentLink4URL: https://datasheet.ciiva.com/15189/getdatasheetpartid-409289-15189591.pdf?src-supplier=Verical; ComponentLink4Description: https://datasheet.ciiva.com/15189/getdatasheetpartid-409289-15189591.pdf?src-supplier=Verical; ComponentLink5URL: https://datasheet.ciiva.com/7660/38590-7660789.pdf?src-supplier=Element14; ComponentLink5Description: https://datasheet.ciiva.com/7660/38590-7660789.pdf?src-supplier=Element14; ComponentLink6URL: https://datasheet.ciiva.com/7746/1738695-7746239.pdf?src-supplier=Element14; ComponentLink6Description: https://datasheet.ciiva.com/7746/1738695-7746239.pdf?src-supplier=Element14; ComponentLink7URL: https://datasheet.ciiva.com/7983/443971-7983596.pdf?src-supplier=Element14; ComponentLink7Description: https://datasheet.ciiva.com/7983/443971-7983596.pdf?src-supplier=Element14; Supplier Part Number 1: 4023214
R71-R75 = RC0603FR-07240RL: RES 240 OHM 0603; Manufacturer: Yageo; Tolerance: 1%; Additional Feature: LASER TRIMMABLE; Rated Power Dissipation (P): 100mW; Rated Temperature: 70°C; Temperature Coefficient: 100ppm/°C; Working Voltage: 75V; Package Height: 0.45mm; Package Length: 1.6mm; Package Width: 0.8mm; Supplier 1: Future Electronics; Manufacturer Part Number: RC0603FR-07240RL; RoHS: Yes; Category: Chip SMD Resistors; Stock 1: 1760000; Pricing 1: 5000=0.0026, 50000=0.0025, 150000=0.0024, 375000=0.0023, 1000000=0.0022 (USD); Mount: Surface Mount; Number of Pins: 2; Package Shape: Rectangular; Size Code: 0603; Terminal Finish: Nickel; Min Operating Temperature: -55°C; Max Operating Temperature: 155°C; JESD-609 Code: e3; Resistor Type: FIXED RESISTOR; Construction: Chip; Package Style: SMTMeter; Packaging: Tape and Reel; Technology: METAL GLAZE/THICK FILM; Termination: Wraparound; Reach SVHC Compliant: Yes; RoHS Compliant: Yes; ComponentLink1URL: https://datasheet.ciiva.com:443/pdfs/VipMasterIC/IC/YAGO/YAGO-S-A0008145938/YAGO-S-A0008145938-1.pdf?src-supplier=IHS+Markit; ComponentLink1Description: https://datasheet.ciiva.com:443/pdfs/VipMasterIC/IC/YAGO/YAGO-S-A0008145938/YAGO-S-A0008145938-1.pdf?src-supplier=IHS+Markit; ComponentLink2URL: https://datasheet.ciiva.com/2508/pyu-r-int-thick-7-2508497.pdf?src-supplier=Digikey; ComponentLink2Description: https://datasheet.ciiva.com/2508/pyu-r-int-thick-7-2508497.pdf?src-supplier=Digikey; ComponentLink3URL: https://datasheet.ciiva.com/2508/pyu-r-int-thick-7-2508498.pdf?src-supplier=Digikey; ComponentLink3Description: https://datasheet.ciiva.com/2508/pyu-r-int-thick-7-2508498.pdf?src-supplier=Digikey; ComponentLink4URL: https://datasheet.ciiva.com/2508/pyu-r-int-thick-7-2508499.pdf?src-supplier=Digikey; ComponentLink4Description: https://datasheet.ciiva.com/2508/pyu-r-int-thick-7-2508499.pdf?src-supplier=Digikey; Supplier Part Number 1: 5308184
TP1 = RCWCTE: SMT Test Point; Manufacturer: KOA Speer; Resistance: 0R; Current Rating: 2A; Number of Contacts: 1; Supplier 1: Digikey; Manufacturer Part Number: RCWCTE; RoHS: Yes; Category: Chip SMD Resistors; Stock 1: 56953; Pricing 1: 1=0.2, 10=0.15, 25=0.1344, 50=0.1238, 100=0.1141, 250=0.10268, 500=0.09488, 1000=0.08781 (USD); Mount: Surface Mount; Case/Package: 1206; Case Code (Imperial): 1206; Case Code (Metric): 3216; Contact Material: Copper,Tin; Min Operating Temperature: -55°C; Max Operating Temperature: 125°C; Packaging: Tape and Reel; Termination: SMD/SMT; Series: RC; Length: 3.2mm; Width: 1.6mm; Height: 2mm; Depth: 1.6mm; Military Standard: Not; RoHS Compliant: Yes; ComponentLink1URL: https://datasheet.ciiva.com/34302/1876186-34302940.pdf?src-supplier=Jameco; ComponentLink1Description: https://datasheet.ciiva.com/34302/1876186-34302940.pdf?src-supplier=Jameco; ComponentLink2URL: https://datasheet.ciiva.com/5556/rc-5556236.pdf?src-supplier=Mouser; ComponentLink2Description: https://datasheet.ciiva.com/5556/rc-5556236.pdf?src-supplier=Mouser; ComponentLink3URL: https://datasheet.ciiva.com/26821/getdatasheetpartid-110197-26821157.pdf?src-supplier=Verical; ComponentLink3Description: https://datasheet.ciiva.com/26821/getdatasheetpartid-110197-26821157.pdf?src-supplier=Verical; Supplier Part Number 1: 2019-RCWCTECT-ND
U9 = TPS566242DRLR: BUCK 3V-16V 6A SOT-563; Manufacturer: Texas Instruments; Supplier 1: Mouser; Manufacturer Part Number: TPS566242DRLR; RoHS: No; Category: Voltage Regulators - Switching; Stock 1: 5599; Pricing 1: 1=0.77, 10=0.667, 50=0.667, 100=0.511, 1000=0.324, 10000=0.259 (USD); Supplier Part Number 1: 595-TPS566242DRLR

## Nets that join several sheets
3V3: Connectors (R9.2 R10.2), PWM-Power (6 pins)
12V: Connectors (12V.1 D1.2 J1.1 J3.1), PWM-Power (5 pins), B1 (5 pins), B2 (5 pins), B3 (5 pins)
GND: Hierarchal (J2.3), Connectors (19 pins), PWM-Power (25 pins), B1 (22 pins), B2 (22 pins), B3 (22 pins)
6V_BUS: Hierarchal (J2.2), B3 (18 pins)